# EAGLE design quadruped-robot (EAGLE 8.6.0)
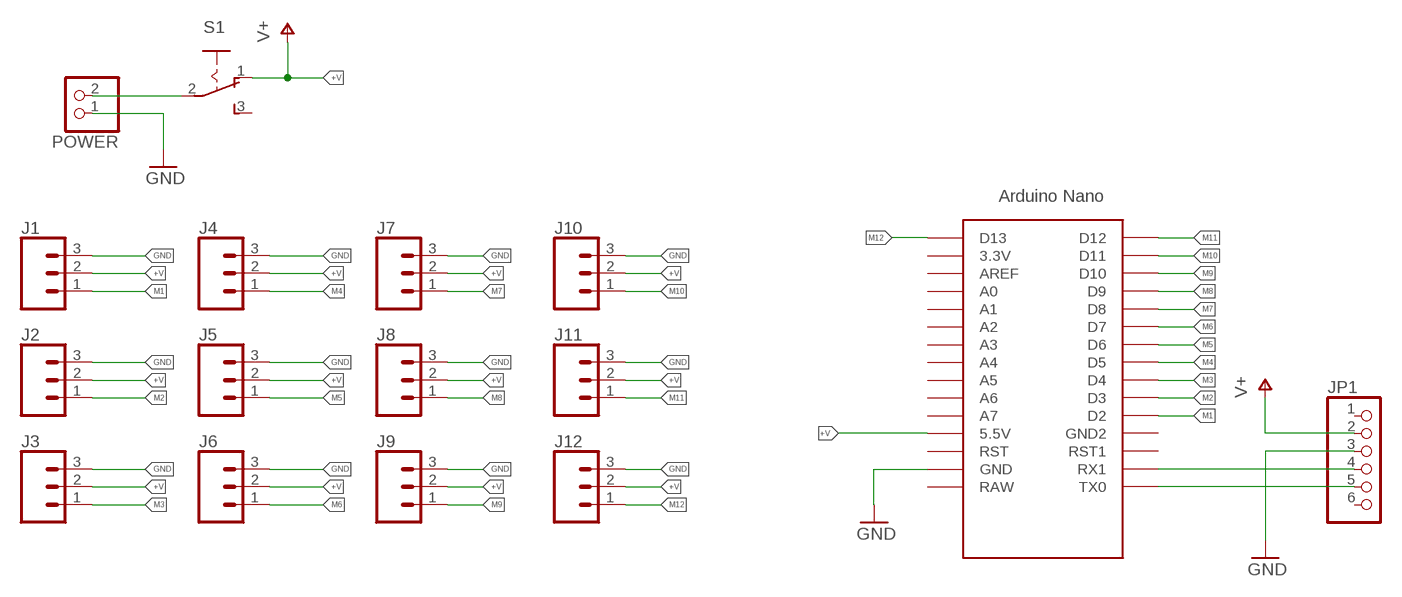
[diagram p0: schematic, sheet 1]

## Parts
J1  CONN_03  [1X03]
J2  CONN_03  [1X03]
J3  CONN_03  [1X03]
J4  CONN_03  [1X03]
J5  CONN_03  [1X03]
J6  CONN_03  [1X03]
J7  CONN_03  [1X03]
J8  CONN_03  [1X03]
J9  CONN_03  [1X03]
J10  CONN_03  [1X03]
J11  CONN_03  [1X03]
J12  CONN_03  [1X03]
JP1  PINHD-1X6  [1X06]
POWER  PINHD-1X2  [1X02]
S1  255SB  [255SB]
U$1  NANO  [NANO]

## Nets
+V: J1.2 J2.2 J3.2 J4.2 J5.2 J6.2 J7.2 J8.2 J9.2 J10.2 J11.2 J12.2 JP1.2 S1.1(O) U$1.5V(5.5V) ; supply symbol labelled V+
GND: J1.3 J2.3 J3.3 J4.3 J5.3 J6.3 J7.3 J8.3 J9.3 J10.3 J11.3 J12.3 JP1.3 POWER.1 U$1.GND
M1: J1.1 U$1.D2
M2: J2.1 U$1.D3
M3: J3.1 U$1.D4
M4: J4.1 U$1.D5
M5: J5.1 U$1.D6
M6: J6.1 U$1.D7
M7: J7.1 U$1.D8
M8: J8.1 U$1.D9
M9: J9.1 U$1.D10
M10: J10.1 U$1.D11
M11: J11.1 U$1.D12
M12: J12.1 U$1.D13
N$1: POWER.2 S1.2(P)
N$3: JP1.5 U$1.TX0
N$4: JP1.4 U$1.RX1
Unconnected: JP1.1 JP1.6 S1.3(S) U$1.3.3V U$1.A0 U$1.A1 U$1.A2 U$1.A3 U$1.A4 U$1.A5 U$1.A6 U$1.A7 U$1.AREF U$1.GND1(GND2) U$1.ICSP1 U$1.ICSP2 U$1.ICSP3 U$1.ICSP4 U$1.ICSP5 U$1.ICSP6 U$1.RAW U$1.RST U$1.RST1

## Library data of the parts
J1-J12 = SparkFun-Connectors:CONN_03: Multi connection point. Often used as Generic Header-pin footprint for 0.1 inch spaced/style header connections On any of the 0.1 inch spaced packages, you can populate with these: Break Away Headers - Straight <https://www.sparkfun.com/products/116> (PRT-00116) Break Away Male Headers - Right Angle <https://www.sparkfun.com/products/553> (PRT-00553) Female Headers <https://www.sparkfun.com/products/115> (PRT-00115) Break Away Headers - Machine Pin <https://www.sparkfun.com/products/117> (PRT-00117) Break Away Female Headers - Swiss Machine Pin <https://www.sparkfun.com/products/743> (PRT-00743) Stackable Header - 3 Pin (Female, 0.1") <https://www.sparkfun.com/products/13875> (PRT-13875) For SCREWTERMINALS and SPRING TERMINALS visit here: Screw Terimnals on SparkFun.com <https://www.sparkfun.com/search/results?term=Screw+Terminals> (5mm/3.5mm/2.54mm spacing) This device is also useful as a general connection point to wire up your design to another part of your project. Our various solder wires solder well into these plated through hole pads. Hook-Up Wire - Assortment (Stranded, 22 AWG) <https://www.sparkfun.com/products/11375> (PRT-11375) Hook-Up Wire - Assortment (Solid Core, 22 AWG) <https://www.sparkfun.com/products/11367> (PRT-11367) View the entire wire category on our website here <https://www.sparkfun.com/categories/141> Special notes: Molex polarized connector foot print use with SKU : PRT-08232 with associated crimp pins and housings.
JP1 = pinhead:PINHD-1X6: PIN HEADER
POWER = pinhead:PINHD-1X2: PIN HEADER
S1 = switch:255SB: SLIDING SWITCH Distributor Buerklin, 11G810
U$1 = Arduino-clone:NANO: Arduino Nano

## Board
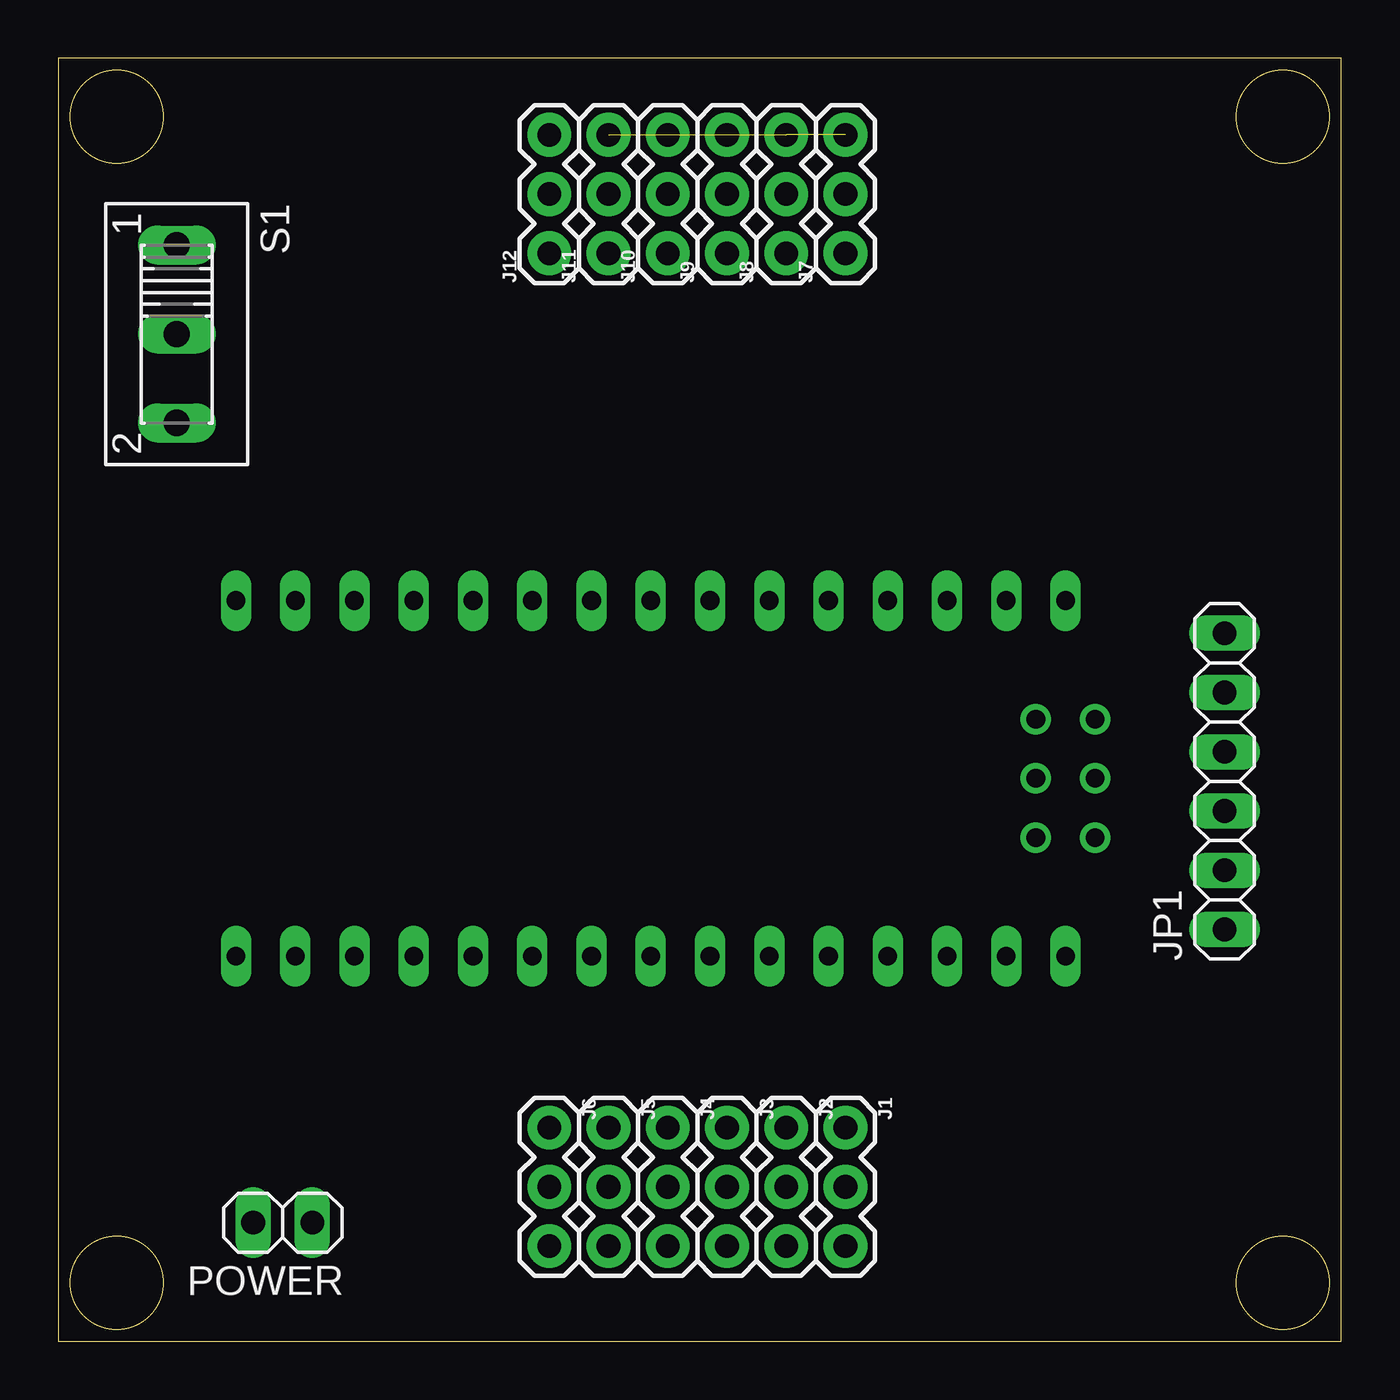
[diagram p1: board, top side]
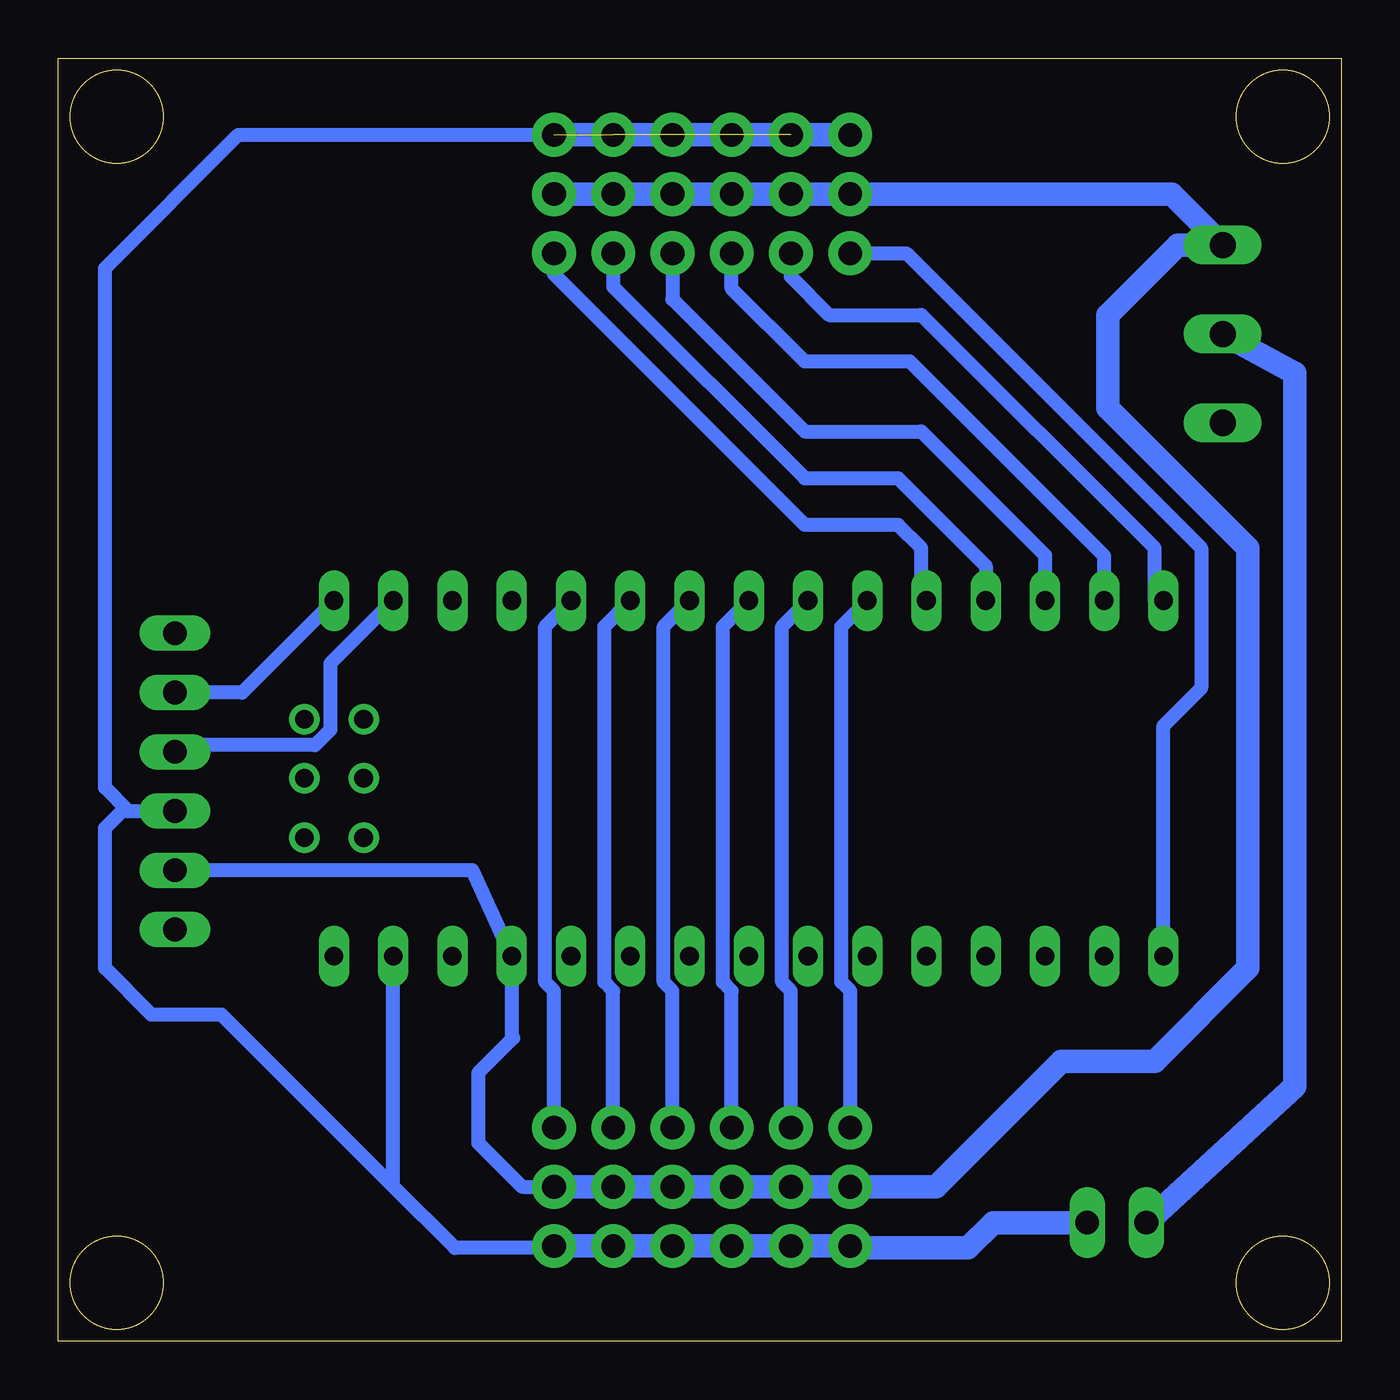
[diagram p2: board, bottom side, seen from below]

Size 55 x 55 mm. Coordinates in mm from the lower left corner, seen from the top.
Outline: 0,0 55,0 55,55 0,55 0,0
Outline: circle at 2.5,2.5 radius 2
Outline: circle at 52.5,2.5 radius 2
Outline: circle at 2.5,52.5 radius 2
Outline: circle at 52.5,52.5 radius 2
Copper layers (1*16): Top 0.035mm / dielectric 1.5mm / Bottom 0.035mm
Design rules "default": minimum track width 6mil, minimum drill 0.35mm, track to track 6mil, track to pad 6mil, pad to pad 6mil, via to via 6mil, smd to smd 6mil, copper to edge 40mil, drill to drill 6mil, minimum pad ring 10mil, minimum via ring 8mil, stop-mask expansion 4mil, vias tented up to drill 0mil, thermal gap 10mil

### Footprints (pad centres in the part's own frame; a part is rotated, then mirrored left to right if it is on the bottom)
1X03 = drill 1.016 pad 1.88: 1 0,0; 2 2.54,0; 3 5.08,0
1X06 = drill 1.016 long: 1 -6.35,0; 2 -3.81,0; 3 -1.27,0; 4 1.27,0; 5 3.81,0; 6 6.35,0
1X02 = drill 1.016 long: 1 -1.27,0; 2 1.27,0
255SB = drill 1.118 long: 1 -3.81,0; 2 0,0; 3 3.81,0
NANO = drill 0.8 long: 3.3V -10.16,24.13; 5V -10.16,-1.27; A0 -10.16,19.05; A1 -10.16,16.51; A2 -10.16,13.97; A3 -10.16,11.43; A4 -10.16,8.89; A5 -10.16,6.35; A6 -10.16,3.81; A7 -10.16,1.27; AREF -10.16,21.59; D2 5.08,1.27; D3 5.08,3.81; D4 5.08,6.35; D5 5.08,8.89; D6 5.08,11.43; D7 5.08,13.97; D8 5.08,16.51; D9 5.08,19.05; D10 5.08,21.59; D11 5.08,24.13; D12 5.08,26.67; D13 -10.16,26.67; GND -10.16,-6.35; GND1 5.08,-1.27; RAW -10.16,-8.89; RST -10.16,-3.81; RST1 5.08,-3.81; RX1 5.08,-6.35; TX0 5.08,-8.89 | drill 0.8: ICSP1 -5.08,-10.16; ICSP2 -5.08,-7.62; ICSP3 -2.54,-10.16; ICSP4 -2.54,-7.62; ICSP5 0,-10.16; ICSP6 0,-7.62

### Placement (x,y rotation side)
J1  33.75,9.16 270 top
J2  31.21,9.16 270 top
J3  28.67,9.16 270 top
J4  26.13,9.16 270 top
J5  23.59,9.16 270 top
J6  21.05,9.16 270 top
J7  33.75,46.64 90 top
J8  31.21,46.64 90 top
J9  28.67,46.64 90 top
J10  26.13,46.64 90 top
J11  23.59,46.64 90 top
J12  21.05,46.64 90 top
JP1  50,24 90 top
POWER  9.62,5.08 180 top
S1  5.08,43.18 270 top
U$1  34.29,26.67 90 top

### Tracks (layer width: path | path; a pad name or v marks a point on that pad's centre or on a via)
+V
  Bottom 0.61: JP1.2 37.24,20.19 U$1.5V 35.56,13.06 35.5,13 37,11.5 37,8.5 35.12,6.62 J1.2
  Bottom 1.016: J1.2 J2.2 J3.2 J4.2 J5.2 J6.2 17.38,6.62 12,12 8,12 4,16 4,34 10,40 10,44 7,47 S1.1 7.27,49.18 J12.2 J11.2 J10.2 J9.2 J8.2 J7.2
GND  (4 unrouted)
  Bottom 0.61: J1.3 33.83,4 38,4 40.64,6.64 | 40.64,6.64 U$1.GND | 40.64,6.64 48,14 51,14 53,16 53,22 52.27,22.73 52,22.73 | 52,22.73 JP1.3 | 52,22.73 53,23.73 53,46 47.28,51.72 J7.3
  Bottom 1.016: J12.3 J7.3 | POWER.1 14.92,5.08 16,4 20.97,4 J6.3 J5.3 J4.3 J3.3 J2.3 J1.3
M1
  Bottom 0.61: J1.1 33.75,15.02 34.13,15.4 34.13,30.64 U$1.D2
M2
  Bottom 0.61: J2.1 31.21,15.02 31.59,15.4 31.59,30.64 U$1.D3
M3
  Bottom 0.61: J3.1 28.67,15.02 29.05,15.4 29.05,30.64 U$1.D4
M4
  Bottom 0.61: J4.1 26.13,15.02 26.51,15.4 26.51,30.64 U$1.D5
M5
  Bottom 0.61: J5.1 23.59,15.02 23.97,15.4 23.97,30.64 U$1.D6
M6
  Bottom 0.61: J6.1 21.05,15.02 21.43,15.4 21.43,30.64 U$1.D7
M7
  Bottom 0.61: U$1.D8 18,31.97 18,34 19,35 23,35 33.75,45.75 J7.1
M8
  Bottom 0.61: J8.1 31.21,45.21 23,37 19,37 15.24,33.24 U$1.D9
M9
  Bottom 0.61: J9.1 28.67,44.67 23,39 18,39 12.7,33.7 U$1.D10
M10
  Bottom 0.61: U$1.D11 10.16,33.66 18.5,42 23,42 26.13,45.13 J10.1
M11
  Bottom 0.61: U$1.D12 8,31.75 8,34 18,44 21.95,44 23.59,45.64 J11.1
M12
  Bottom 0.61: U$1.D13 7.62,26.38 6,28 6,34 18.64,46.64 J12.1
N$1
  Bottom 1.016: S1.2 2,41.5 2,10.93 POWER.2
N$3
  Bottom 0.61: U$1.TX0 47.12,27.81 JP1.5
N$4
  Bottom 0.61: U$1.RX1 43.34,29.05 43.34,26.21 43.99,25.56 49.71,25.56 JP1.4